# Altium schematic sheet Debugger.SchDoc: FTDI Debugger
size A4; Author: nand; DocumentNumber: 1; Revision: V0.1; SheetNumber: 1; SheetTotal: 1
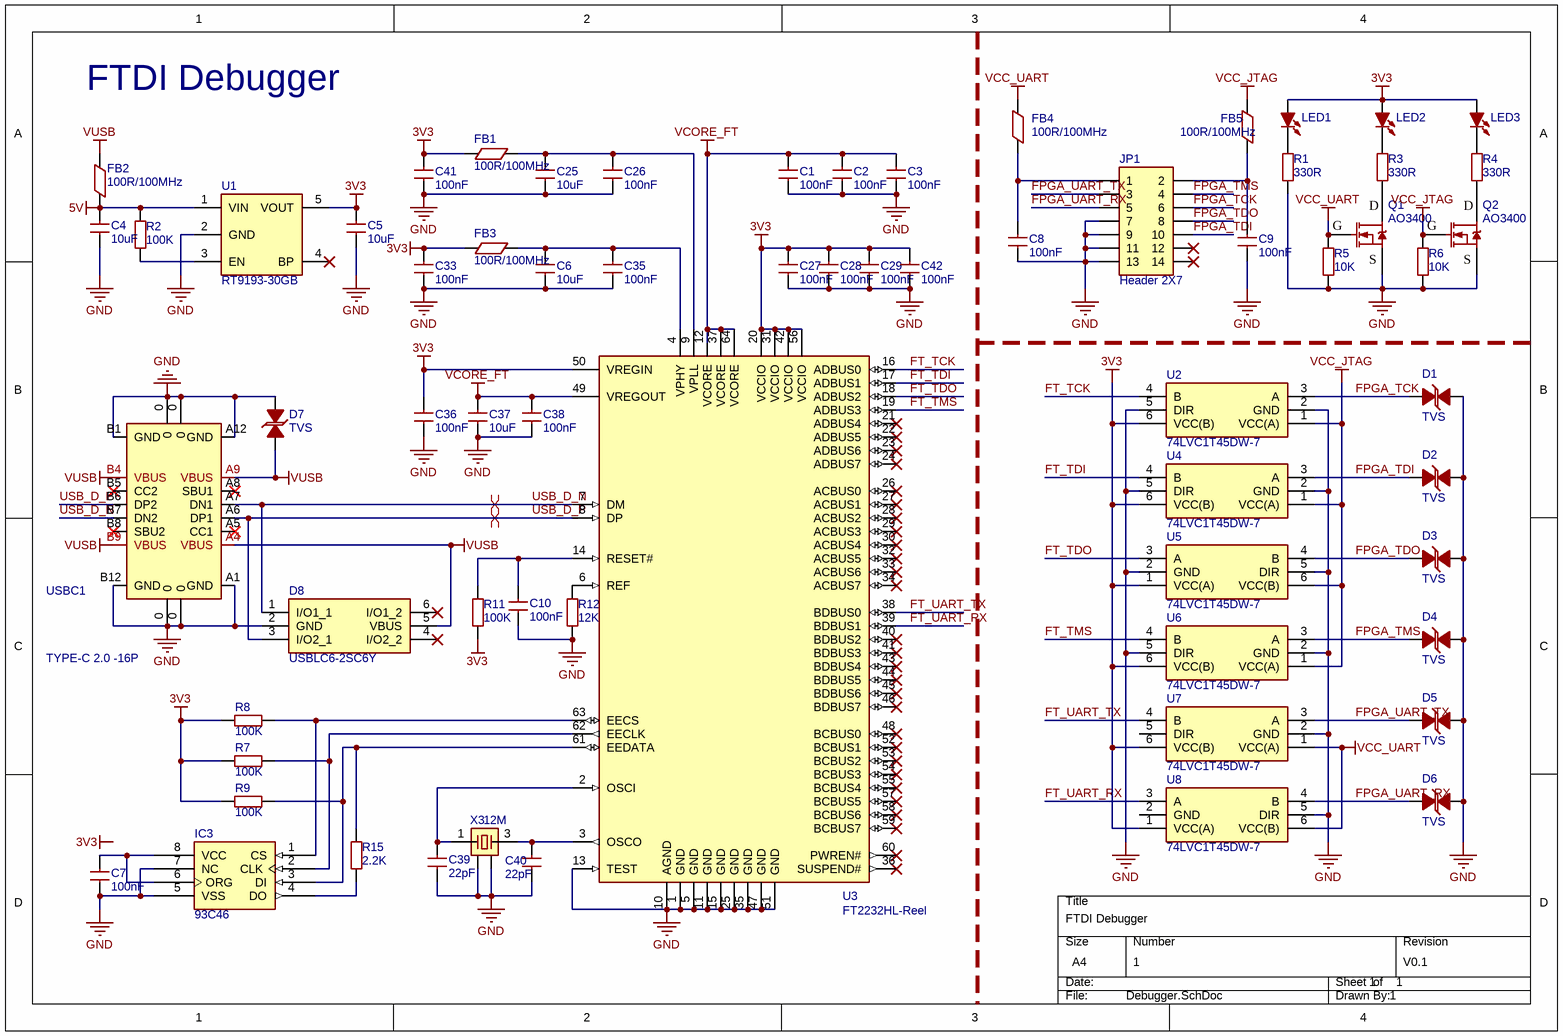
[diagram p0: Debugger.SchDoc]

## Parts
C1  100nF  [C0603_NS]
C2  100nF  [C0603_NS]
C3  100nF  [C0603_NS]
C4  10uF  [C0603_NS]
C5  10uF  [C0603_NS]
C6  10uF  [C0603_NS]
C7  100nF  [C0603_NS]
C8  100nF  [C0603_NS]
C9  100nF  [C0603_NS]
C10  100nF  [C0603_NS]
C25  10uF  [C0603_NS]
C26  100nF  [C0603_NS]
C27  100nF  [C0603_NS]
C28  100nF  [C0603_NS]
C29  100nF  [C0603_NS]
C33  100nF  [C0603_NS]
C35  100nF  [C0603_NS]
C36  100nF  [C0603_NS]
C37  10uF  [C0603_NS]
C38  100nF  [C0603_NS]
C39  22pF  [C0603_NS]
C40  22pF  [C0603_NS]
C41  100nF  [C0603_NS]
C42  100nF  [C0603_NS]
D1  TVS  [SOD-123]
D2  TVS  [SOD-123]
D3  TVS  [SOD-123]
D4  TVS  [SOD-123]
D5  TVS  [SOD-123]
D6  TVS  [SOD-123]
D7  TVS  [SOD-123]
D8  USBLC6-2SC6Y  [SOT95P280X145-6N]
FB1  100R/100MHz  [R0805_L]
FB2  100R/100MHz  [R0805_L]
FB3  100R/100MHz  [R0805_L]
FB4  100R/100MHz  [R0805_L]
FB5  100R/100MHz  [R0805_L]
IC3  93C46  [SOP8_L]
JP1  Header 2X7  [HDR2.54-WI-2x7P]
LED1  红色  [LED0603_R]  (value not drawn)
LED2  红色  [LED0603_R]  (value not drawn)
LED3  红色  [LED0603_R]  (value not drawn)
Q1  AO3400  [SOT23-3N]
Q2  AO3400  [SOT23-3N]
R1  330R  [R0603_NS]
R2  100K  [R0603_NS]
R3  330R  [R0603_NS]
R4  330R  [R0603_NS]
R5  10K  [R0603_NS]
R6  10K  [R0603_NS]
R7  100K  [R0603_NS]
R8  100K  [R0603_NS]
R9  100K  [R0603_NS]
R11  100K  [R0603_NS]
R12  12K  [R0603_NS]
R15  2.2K  [R0603_NS]
U1  RT9193-30GB  [SOT-23-5]
U2  74LVC1T45DW-7  [SOT65P210X110-6N]
U3  FT2232HL-Reel  [LQFP64-10*10]
U4  74LVC1T45DW-7  [SOT65P210X110-6N]
U5  74LVC1T45DW-7  [SOT65P210X110-6N]
U6  74LVC1T45DW-7  [SOT65P210X110-6N]
U7  74LVC1T45DW-7  [SOT65P210X110-6N]
U8  74LVC1T45DW-7  [SOT65P210X110-6N]
USBC1  TYPE-C 2.0 -16P  [USB-C-SMD_16P]
X3  12M  [XTAL-3225-4P]

## Nets
3V3: C5.1 C27.2 C28.2 C29.2 C33.2 C36.2 C41.2 C42.2 FB1.1 FB3.1 LED1.1(A) LED2.1(A) LED3.1(A) R7.2 R8.2 R9.2 R11.2 U1.5(VOUT) U2.6(VCC(B)) U3.20(VCCIO) U3.31(VCCIO) U3.42(VCCIO) U3.50(VREGIN) U3.56(VCCIO) U4.6(VCC(B)) U5.1(VCC(A)) U6.6(VCC(B)) U7.6(VCC(B)) U8.1(VCC(A))
5V: C4.2 FB2.1 R2.1 U1.1(VIN)
GND: C1.1 C2.1 C3.1 C4.1 C5.2 C6.1 C7.1 C8.1 C9.1 C10.1 C25.1 C26.1 C27.1 C28.1 C29.1 C33.1 C35.1 C36.1 C37.1 C38.1 C39.1 C40.1 C41.1 C42.1 D1.2(K) D2.2(K) D3.2(K) D4.2(K) D5.2(K) D6.2(K) D7.1(A) D8.2(GND) IC3.5(VSS) IC3.7(NC) JP1.7 JP1.9 JP1.11 JP1.13 Q1.2(S) Q2.2(S) R1.2 R5.2 R6.2 R12.1 U1.2(GND) U2.2(GND) U2.5(DIR) U3.1(GND) U3.5(GND) U3.10(AGND) U3.11(GND) U3.13(TEST) U3.15(GND) U3.25(GND) U3.35(GND) U3.47(GND) U3.51(GND) U4.2(GND) U4.5(DIR) U5.2(GND) U5.5(DIR) U6.2(GND) U6.5(DIR) U7.2(GND) U8.5(DIR) USBC1.0 USBC1.A1(GND) USBC1.A12(GND) USBC1.B1(GND) USBC1.B12(GND) X3.2 X3.4
VCC_JTAG: FB5.2 Q2.1(G) R6.1 U2.1(VCC(A)) U4.1(VCC(A)) U5.6(VCC(B)) U6.1(VCC(A))
VCC_UART: FB4.2 Q1.1(G) R5.1 U7.1(VCC(A)) U8.6(VCC(B))
VCORE_FT: C1.2 C2.2 C3.2 C37.2 C38.2 U3.12(VCORE) U3.37(VCORE) U3.49(VREGOUT) U3.64(VCORE)
VUSB: D7.2(K) D8.5(VBUS) FB2.2 USBC1.A4(VBUS) USBC1.A9(VBUS) USBC1.B4(VBUS) USBC1.B9(VBUS)
FPGA_TCK: D1.1(A) JP1.6 U2.3(A)
FPGA_TDI: D2.1(A) JP1.10 U4.3(A)
FPGA_TDO: D3.1(A) JP1.8 U5.4(B)
FPGA_TMS: D4.1(A) JP1.4 U6.3(A)
FPGA_UART_RX: D6.1(A) JP1.5 U8.4(B)
FPGA_UART_TX: D5.1(A) JP1.3 U7.3(A)
FT_TCK: U2.4(B) U3.16(ADBUS0)
FT_TDI: U3.17(ADBUS1) U4.4(B)
FT_TDO: U3.18(ADBUS2) U5.3(A)
FT_TMS: U3.19(ADBUS3) U6.4(B)
FT_UART_RX: U3.39(BDBUS1) U8.3(A)
FT_UART_TX: U3.38(BDBUS0) U7.4(B)
USB_D_N: D8.1(I/O1_1) U3.7(DM) USBC1.A7(DN1) USBC1.B7(DN2)
USB_D_P: D8.3(I/O2_1) U3.8(DP) USBC1.A6(DP1) USBC1.B6(DP2)
NetC6_2: C6.2 C35.2 FB3.2 U3.4(VPHY)
NetC7_2: C7.2 IC3.6(ORG) IC3.8(VCC)
NetC8_2: C8.2 FB4.1 JP1.1
NetC9_2: C9.2 FB5.1 JP1.2
NetC10_2: C10.2 R11.1 U3.14(RESET#)
NetC25_2: C25.2 C26.2 FB1.2 U3.9(VPLL)
NetC39_2: C39.2 U3.2(OSCI) X3.1
NetC40_2: C40.2 U3.3(OSCO) X3.3
NetIC3_1: IC3.1(CS) R8.1 U3.63(EECS)
NetIC3_2: IC3.2(CLK) R7.1 U3.62(EECLK)
NetIC3_3: IC3.3(DI) R9.1 R15.1 U3.61(EEDATA)
NetIC3_4: IC3.4(DO) R15.2
NetLED1_2: LED1.2(K) R1.1
NetLED2_2: LED2.2(K) R3.1
NetLED3_2: LED3.2(K) R4.1
NetQ1_3: Q1.3(D) R3.2
NetQ2_3: Q2.3(D) R4.2
NetR2_2: R2.2 U1.3(EN)
NetR12_2: R12.2 U3.6(REF)

Not connected (* = marked no-connect by the designer): D8 4(I/O2_2)* 6(I/O1_2)*; JP1 12* 14*; U1 4(BP)*; U3 21(ADBUS4)* 22(ADBUS5)* 23(ADBUS6)* 24(ADBUS7)* 26(ACBUS0)* 27(ACBUS1)* 28(ACBUS2)* 29(ACBUS3)* 30(ACBUS4)* 32(ACBUS5)* 33(ACBUS6)* 34(ACBUS7)* 36(SUSPEND#)* 40(BDBUS2)* 41(BDBUS3)* 43(BDBUS4)* 44(BDBUS5)* 45(BDBUS6)* 46(BDBUS7)* 48(BCBUS0)* 52(BCBUS1)* 53(BCBUS2)* 54(BCBUS3)* 55(BCBUS4)* 57(BCBUS5)* 58(BCBUS6)* 59(BCBUS7)* 60(PWREN#)*; U7 5(DIR); U8 2(GND); USBC1 A5(CC1)* A8(SBU1)* B5(CC2)* B8(SBU2)*

## Layout directives
differential pair: USB_D_N, USB_D_P

## Notes on the sheet
- Labels drawn without touching a wire or pin: 3V3

## Library data of the parts
C1-C10 C25-C29 C33 C35-C42 = C: 贴片电容/MLCC电容; BOM名称: 无极性贴片电容; 联系卖家，免费查找封装: 唯一出售店铺网址https://shop463601444.taobao.com
D1-D7 = TVS: TVS通用; 以赠品形式获赠本封装库的买家，还可联系卖家免费指导AD软件使用: 封装库来自淘宝卖家ID：黄晶宝石; Code_JEDEC: DO-214-AB
D8 = USBLC6-2SC6Y: Diode; Manufacturer_Name: STMicroelectronics; Datasheet Link: https://componentsearchengine.com/Datasheets/1/USBLC6-2SC6Y.pdf; Height: 1.45mm; Manufacturer_Part_Number: USBLC6-2SC6Y; Mouser Part Number: 511-USBLC6-2SC6Y; Mouser Price/Stock: https://www.mouser.co.uk/ProductDetail/STMicroelectronics/USBLC6-2SC6Y?qs=gNDSiZmRJS%2FOgDexvXkdow%3D%3D; Arrow Part Number: USBLC6-2SC6Y; Arrow Price/Stock: https://www.arrow.com/en/products/usblc6-2sc6y/stmicroelectronics?region=nac
FB1-FB5 = FB: 贴片磁珠; 联系卖家，免费查找封装: 唯一出售店铺网址https://shop463601444.taobao.com; BOM名称: 贴片磁珠
IC3 = 93C46: 外置EEPROM; 联系卖家 免费查找封装: 唯一出售店铺网址https://shop463601444.taobao.com; BOM名称: 外置EEPROM
JP1 = Header 7X2: 7*2P接插件; 联系卖家，免费查找封装: 唯一出售店铺网址https://shop463601444.taobao.com; 封装库来自淘宝卖家ID:黄晶宝石: 其他店铺购入均为盗版假冒封装库，请立即申请退款，本店现金奖励20~200元; BOM名称: 7*2P接插件
LED1-LED3 = LED-SMD: 贴片LED; 封装库来自淘宝卖家ID：黄晶宝石: 其他店铺购入均为盗版封装库，请立即申请退款，本店现金奖励20~200元; BOM名称: 贴片LED
Q1 Q2 = AO3400: N沟道 30V/4.2A; BOM名称: 场效应管; 8元以下特价购入的买家: 还可以联系卖家远程指导AD软件使用; 参数: N沟道 30V/4.2A
R1-R9 R11 R12 R15 = R: 贴片电阻; 联系卖家，免费查找封装: 唯一出售店铺网址https://shop463601444.taobao.com; BOM名称: 贴片电阻
U1 = RT9193-30GB: LDO 3.0V/0.3A; 芯片厂商: RICHTEK; 封装库来自淘宝卖家ID：黄晶宝石: 其他店铺购入的买家，请立即申请退款，本店现金奖励20~1000元; BOM名称: RT9193-30GB
U2 U4-U8 = 74LVC1T45DW-7: Undefined or Miscellaneous; Manufacturer_Name: Diodes Inc.; Datasheet Link: https://www.diodes.com/assets/Datasheets/74LVC1T45.pdf; Height: 1.1mm; Manufacturer_Part_Number: 74LVC1T45DW-7; Mouser Part Number: 621-74LVC1T45DW-7; Mouser Price/Stock: https://www.mouser.co.uk/ProductDetail/Diodes-Incorporated/74LVC1T45DW-7?qs=Oxncjon6mbplzGvxR3UXkA%3D%3D; Arrow Part Number: 74LVC1T45DW-7; Arrow Price/Stock: https://www.arrow.com/en/products/74lvc1t45dw-7/diodes-incorporated?region=nac
U3 = CMP-0078-00023-3: Dual High Speed USB To Multipurpose UART/FIFO IC, 64-pin LQFP, Tape and Reel; Manufacturer: FTDI; DatasheetVersion: ver 2.21, Jun-2012; ComponentLink1URL: http://www.ftdichip.com/; PartNumber: FT2232HL-Reel; ComponentLink2Description: Datasheet; RevisionNote: DatasheetVersion updated to 2.21 Jun-2012; PackageVersion: Jun-12; ComponentLink1Description: Manufacturer URL; ComponentLink2URL: http://www.ftdichip.com/Support/Documents/DataSheets/ICs/DS_FT2232H.pdf; PackageReference: LQFP-64; PackageDescription: 64-Pin Thin Quad Flat Pack, 10 x 10 x 1.4 mm Body, 0.5 mm Pitch
USBC1 = USB2.0_Type-C_16Pin: USB2.0_Type-C_16Pin母座; 联系卖家 免费技术支持: 封装库来自淘宝卖家ID：黄晶宝石
X3 = XTAL-4P: 4脚无源晶振(谐振器）; 联系卖家，免费查找封装: 唯一出售店铺网址https://shop463601444.taobao.com; BOM名称: 4脚无源晶振(谐振器）